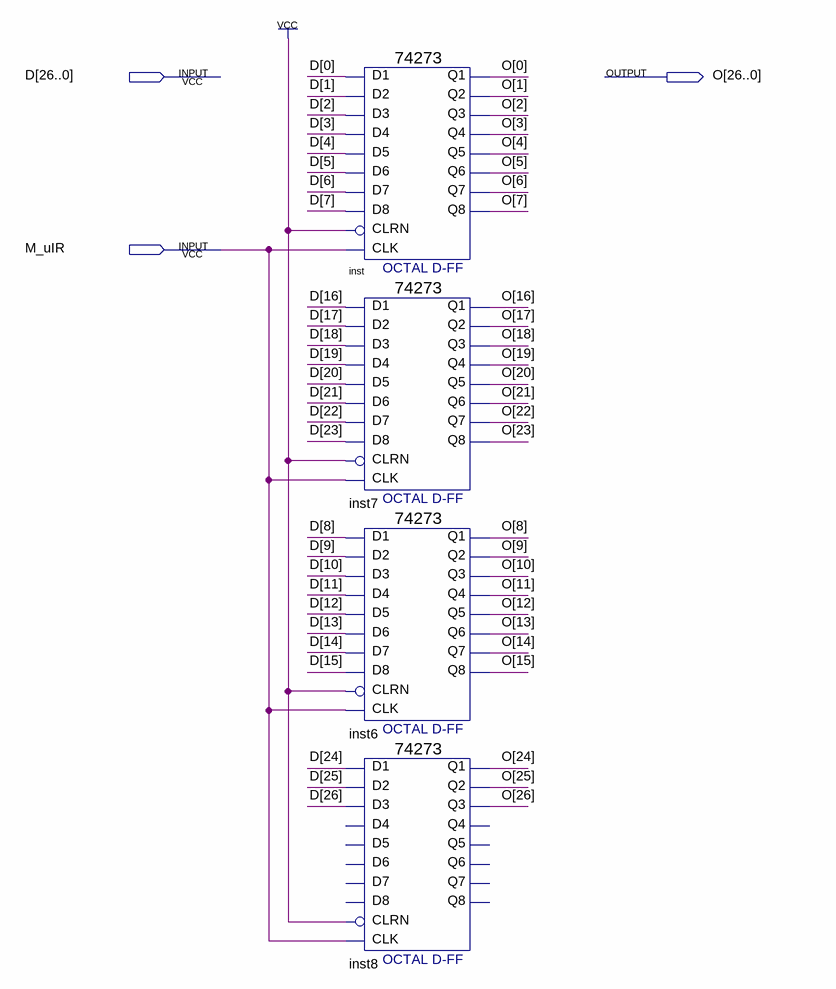
[diagram p0: schematic sheet]
// Quartus schematic uIR.bdf as structural Verilog: 4 symbols, 3 pins
module uIR (
  input  [26:0] D,
  input  M_uIR,
  output [26:0] O
);

  \74273  inst (
    .D2(D[1]), .D3(D[2]), .D1(D[0]), .D4(D[3]), .D7(D[6]), .D6(D[5]), .D5(D[4]), .D8(D[7]), .CLK(M_uIR),
    .CLRN(1'b1), .Q4(O[3]), .Q1(O[0]), .Q2(O[1]), .Q3(O[2]), .Q6(O[5]), .Q5(O[4]), .Q7(O[6]), .Q8(O[7]));
  \74273  inst7 (
    .D2(D[17]), .D3(D[18]), .D1(D[16]), .D4(D[19]), .D7(D[22]), .D6(D[21]), .D5(D[20]), .D8(D[23]),
    .CLK(M_uIR), .CLRN(1'b1), .Q4(O[19]), .Q1(O[16]), .Q2(O[17]), .Q3(O[18]), .Q6(O[21]), .Q5(O[20]),
    .Q7(O[22]), .Q8(O[23]));
  \74273  inst6 (
    .D2(D[9]), .D3(D[10]), .D1(D[8]), .D4(D[11]), .D7(D[14]), .D6(D[13]), .D5(D[12]), .D8(D[15]),
    .CLK(M_uIR), .CLRN(1'b1), .Q4(O[11]), .Q1(O[8]), .Q2(O[9]), .Q3(O[10]), .Q6(O[13]), .Q5(O[12]),
    .Q7(O[14]), .Q8(O[15]));
  \74273  inst8 (
    .D2(D[25]), .D3(D[26]), .D1(D[24]), .CLK(M_uIR), .CLRN(1'b1), .Q1(O[24]), .Q2(O[25]), .Q3(O[26]));  // open: D4, D7, D6, D5, D8, Q4, Q6, Q5, Q7, Q8
endmodule
